# Altium schematic sheet IO.SchDoc
size A2
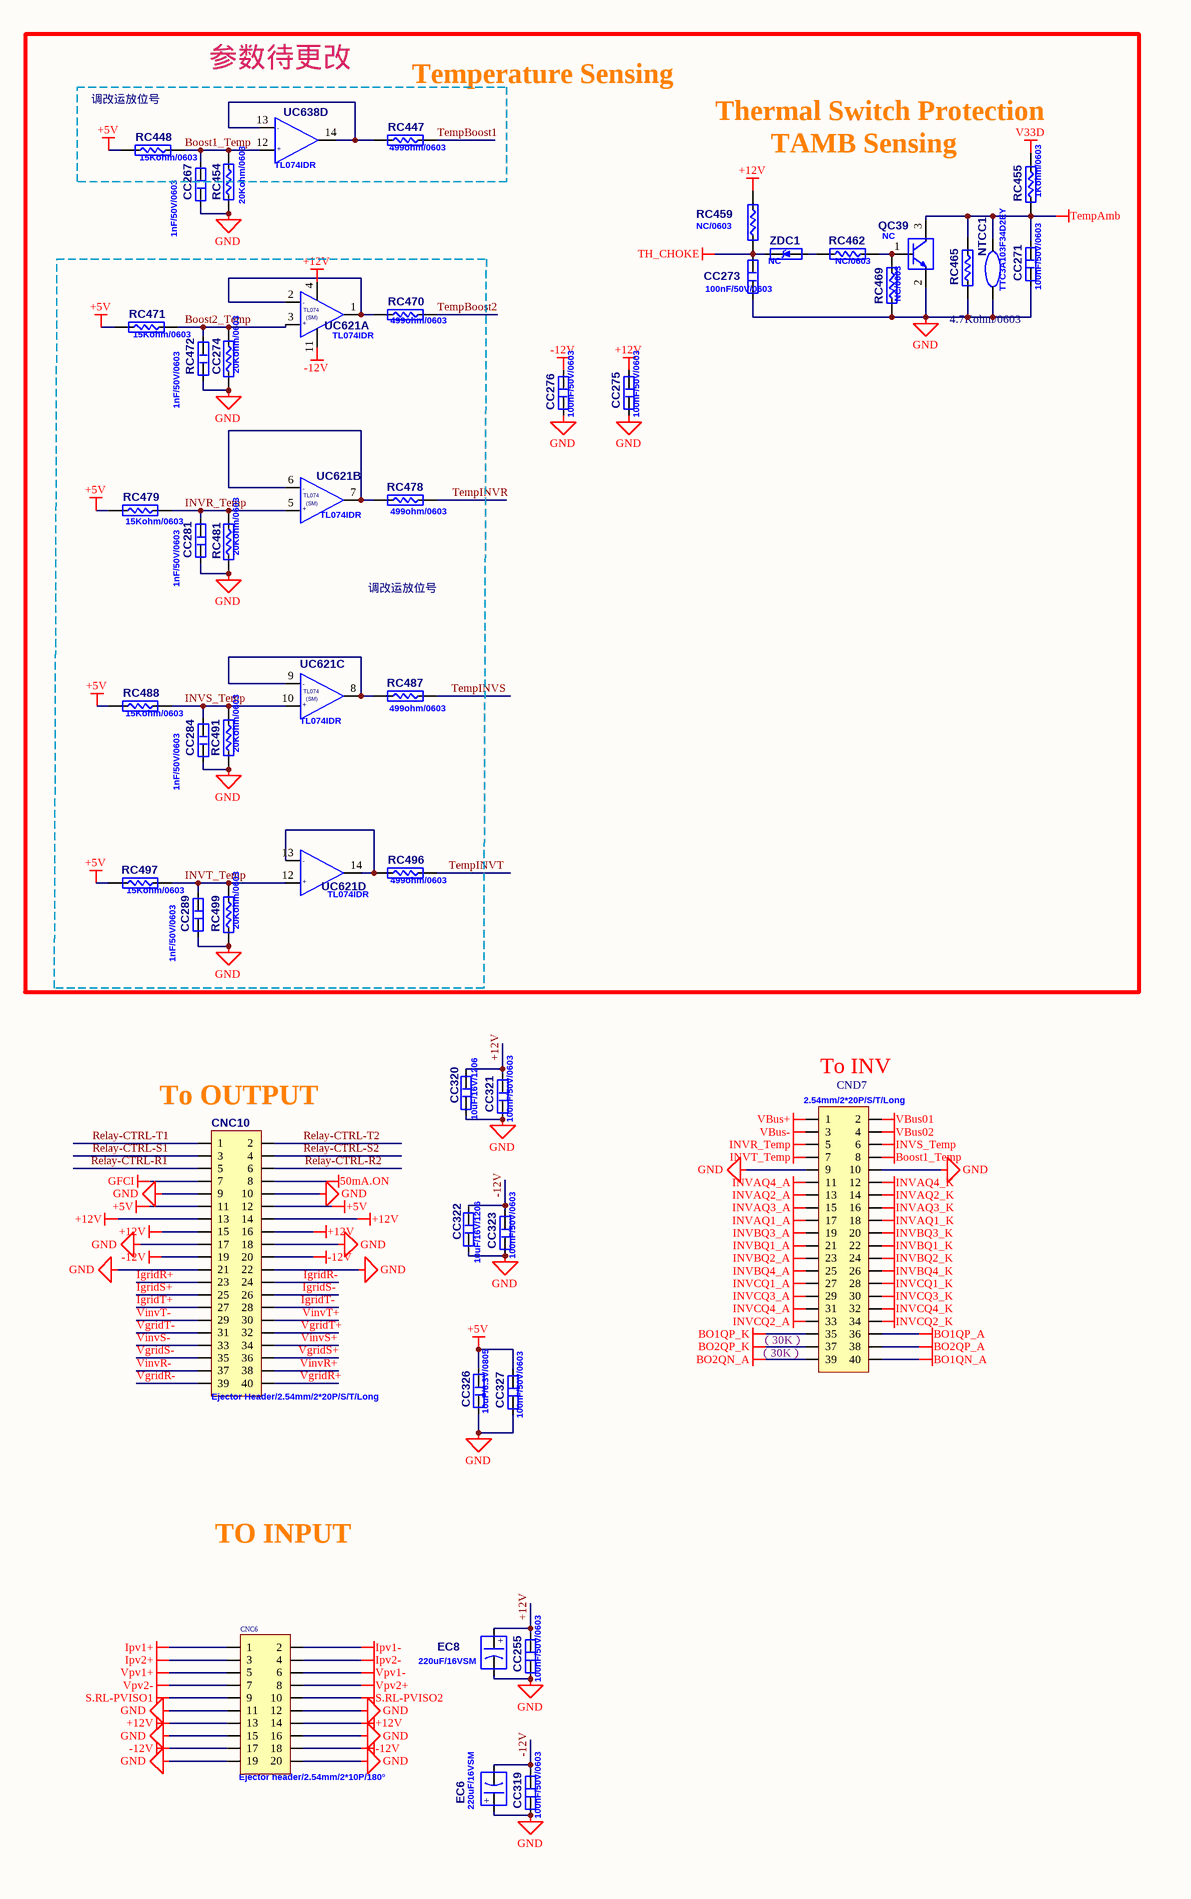
[diagram p0: IO.SchDoc, left]
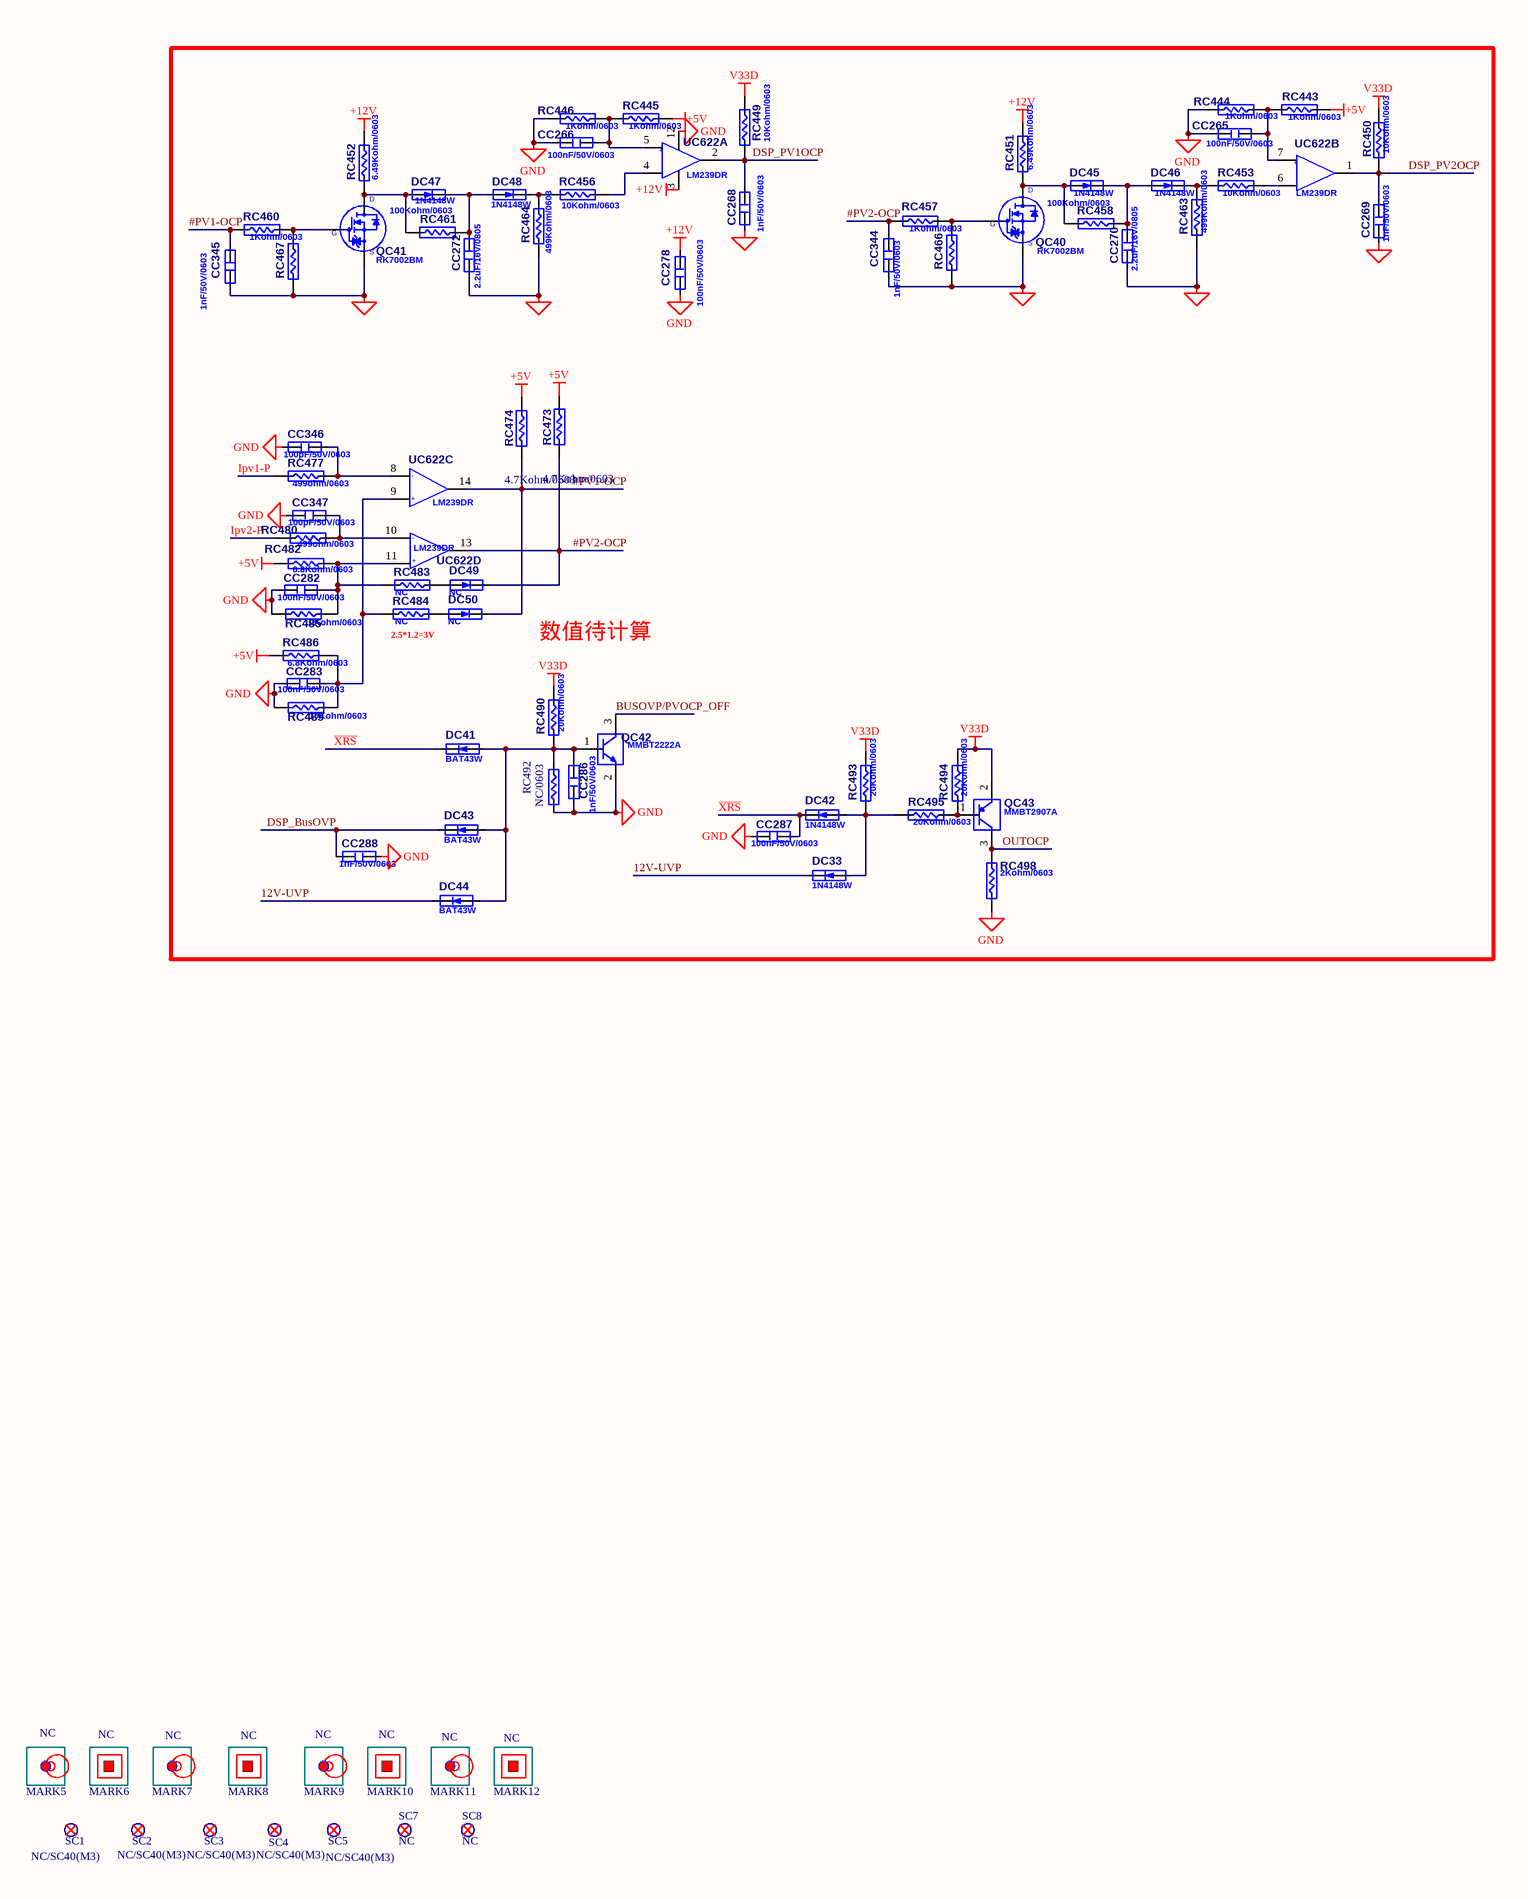
[diagram p1: IO.SchDoc, right]

## Parts
CC255  value 100nF/50V/0603  [CC1608-0603]  (hidden comment: 023-105220-0)
CC265  value 100nF/50V/0603  [CC1608-0603]  (hidden comment: 023-105220-0)
CC266  value 100nF/50V/0603  [CC1608-0603]  (hidden comment: 023-105220-0)
CC267  value 1nF/50V/0603  [CC1608-0603]  (hidden comment: 023-102220-0)
CC268  value 1nF/50V/0603  [CC1608-0603]  (hidden comment: 023-102220-0)
CC269  value 1nF/50V/0603  [CC1608-0603]  (hidden comment: 023-102220-0)
CC270  value 2.2uF/16V/0805  [CC2012-0805]  (hidden comment: 023-225330-0)
CC271  value 100nF/50V/0603  [CC1608-0603]  (hidden comment: 023-105220-0)
CC272  value 2.2uF/16V/0805  [CC2012-0805]  (hidden comment: 023-225330-0)
CC273  value 100nF/50V/0603  [CC1608-0603]  (hidden comment: 023-105220-0)
CC274  value 1nF/50V/0603  [CC1608-0603]  (hidden comment: 023-102220-0)
CC275  value 100nF/50V/0603  [CC1608-0603]  (hidden comment: 023-105220-0)
CC276  value 100nF/50V/0603  [CC1608-0603]  (hidden comment: 023-105220-0)
CC278  value 100nF/50V/0603  [CC1608-0603]  (hidden comment: 023-105220-0)
CC281  value 1nF/50V/0603  [CC1608-0603]  (hidden comment: 023-102220-0)
CC282  value 100nF/50V/0603  [CC1608-0603]  (hidden comment: 023-105220-0)
CC283  value 100nF/50V/0603  [CC1608-0603]  (hidden comment: 023-105220-0)
CC284  value 1nF/50V/0603  [CC1608-0603]  (hidden comment: 023-102220-0)
CC286  value 1nF/50V/0603  [CC1608-0603]  (hidden comment: 023-102220-0)
CC287  value 100nF/50V/0603  [CC1608-0603]  (hidden comment: 023-105220-0)
CC288  value 1nF/50V/0603  [CC1608-0603]  (hidden comment: 023-102220-0)
CC289  value 1nF/50V/0603  [CC1608-0603]  (hidden comment: 023-102220-0)
CC319  value 100nF/50V/0603  [CC1608-0603]  (hidden comment: 023-105220-0)
CC320  value 10uF/16V/1206  [CC3216-1206]  (hidden comment: 023-106350-0)
CC321  value 100nF/50V/0603  [CC1608-0603]  (hidden comment: 023-105220-0)
CC322  value 10uF/16V/1206  [CC3216-1206]  (hidden comment: 023-106350-0)
CC323  value 100nF/50V/0603  [CC1608-0603]  (hidden comment: 023-105220-0)
CC326  value 10uF/6.3V/0805  [CC2012-0805]  (hidden comment: 023-106330-0)
CC327  value 100nF/50V/0603  [CC1608-0603]  (hidden comment: 023-105220-0)
CC344  value 1nF/50V/0603  [CC1608-0603]  (hidden comment: 023-102220-0)
CC345  value 1nF/50V/0603  [CC1608-0603]  (hidden comment: 023-102220-0)
CC346  value 100pF/50V/0603  [CC1608-0603]  (hidden comment: 023-101220-0)
CC347  value 100pF/50V/0603  [CC1608-0603]  (hidden comment: 023-101220-0)
CNC6  value Ejector header/2.54mm/2*10P/180°  [CN2.54-2*10P_2]  (hidden comment: 110-103250-0)
CNC10  value Ejector Header/2.54mm/2*20P/S/T/Long  [CN2.54-2*20P]  (hidden comment: 110-310000-0)
CND7  value 2.54mm/2*20P/S/T/Long  [CN2.54-2*20P]  (hidden comment: 110-310000-0)
DC33  value 1N4148W  [SOD-123]  (hidden comment: 060-500010-0)
DC41  value BAT43W  [SOD-123]  (hidden comment: 060-310000-0)
DC42  value 1N4148W  [SOD-123]  (hidden comment: 060-500010-0)
DC43  value BAT43W  [SOD-123]  (hidden comment: 060-310000-0)
DC44  value BAT43W  [SOD-123]  (hidden comment: 060-310000-0)
DC45  value 1N4148W  [SOD-123]  (hidden comment: 060-500010-0)
DC46  value 1N4148W  [SOD-123]  (hidden comment: 060-500010-0)
DC47  value 1N4148W  [SOD-123]  (hidden comment: 060-500010-0)
DC48  value 1N4148W  [SOD-123]  (hidden comment: 060-500010-0)
DC49  NC  [SOD-123]
DC50  NC  [SOD-123]
EC6  value 220uF/16VSM  [EC220UF/16VSM-6.3]  (hidden comment: 020-227100-1)
EC8  value 220uF/16VSM  [EC220UF/16VSM-6.3]  (hidden comment: 020-227100-1)
MARK5  NC  [MARK_A]
MARK6  NC  [MARK_B]
MARK7  NC  [MARK_A]
MARK8  NC  [MARK_B]
MARK9  NC  [MARK_A]
MARK10  NC  [MARK_B]
MARK11  NC  [MARK_A]
MARK12  NC  [MARK_B]
NTCC1  value TTC3A103F34D2EY  [TTC3A103F34D2EY]  (hidden comment: 016-103000-0)
QC39  NC  [SOT-23]
QC40  value RK7002BM  [SOT-23 - 1]  (hidden comment: 063-010010-0)
QC41  value RK7002BM  [SOT-23 - 1]  (hidden comment: 063-010010-0)
QC42  value MMBT2222A  [SOT-23]  (hidden comment: 061-010000-0)
QC43  value MMBT2907A  [SOT-23]  (hidden comment: 061-110000-0)
RC443  value 1Kohm/0603  [R1608-0603]  (hidden comment: 011-102020-0)
RC444  value 1Kohm/0603  [R1608-0603]  (hidden comment: 011-102020-0)
RC445  value 1Kohm/0603  [R1608-0603]  (hidden comment: 011-102020-0)
RC446  value 1Kohm/0603  [R1608-0603]  (hidden comment: 011-102020-0)
RC447  value 499ohm/0603  [R1608-0603]  (hidden comment: 011-491020-0)
RC448  value 15Kohm/0603  [R1608-0603]  (hidden comment: 011-153020-0)
RC449  value 10Kohm/0603  [R1608-0603]  (hidden comment: 011-103020-0)
RC450  value 10Kohm/0603  [R1608-0603]  (hidden comment: 011-103020-0)
RC451  value 6.49Kohm/0603  [R1608-0603]  (hidden comment: 011-642020-0)
RC452  value 6.49Kohm/0603  [R1608-0603]  (hidden comment: 011-642020-0)
RC453  value 10Kohm/0603  [R1608-0603]  (hidden comment: 011-103020-0)
RC454  value 20Kohm/0603  [R1608-0603]  (hidden comment: 011-203020-0)
RC455  value 1Kohm/0603  [R1608-0603]  (hidden comment: 011-102020-0)
RC456  value 10Kohm/0603  [R1608-0603]  (hidden comment: 011-103020-0)
RC457  value 1Kohm/0603  [R1608-0603]  (hidden comment: 011-102020-0)
RC458  value 100Kohm/0603  [R1608-0603]  (hidden comment: 011-104020-0)
RC459  NC/0603  [R1608-0603]
RC460  value 1Kohm/0603  [R1608-0603]  (hidden comment: 011-102020-0)
RC461  value 100Kohm/0603  [R1608-0603]  (hidden comment: 011-104020-0)
RC462  NC/0603  [R1608-0603]
RC463  value 499Kohm/0603  [R1608-0603]  (hidden comment: 011-494020-0)
RC464  value 499Kohm/0603  [R1608-0603]  (hidden comment: 011-494020-0)
RC465  value 4.7Kohm/0603  [R1608-0603]  (hidden comment: 011-472020-0)
RC466  011-493020-0  [R1608-0603]  (value not drawn)
RC467  011-493020-0  [R1608-0603]  (value not drawn)
RC469  NC/0603  [R1608-0603]
RC470  value 499ohm/0603  [R1608-0603]  (hidden comment: 011-491020-0)
RC471  value 15Kohm/0603  [R1608-0603]  (hidden comment: 011-153020-0)
RC472  value 20Kohm/0603  [R1608-0603]  (hidden comment: 011-203020-0)
RC473  value 4.7Kohm/0603  [R1608-0603]  (hidden comment: 011-472020-0)
RC474  value 4.7Kohm/0603  [R1608-0603]  (hidden comment: 011-472020-0)
RC477  value 499ohm/0603  [R1608-0603]  (hidden comment: 011-491020-0)
RC478  value 499ohm/0603  [R1608-0603]  (hidden comment: 011-491020-0)
RC479  value 15Kohm/0603  [R1608-0603]  (hidden comment: 011-153020-0)
RC480  value 499ohm/0603  [R1608-0603]  (hidden comment: 011-491020-0)
RC481  value 20Kohm/0603  [R1608-0603]  (hidden comment: 011-203020-0)
RC482  value 6.8Kohm/0603  [R1608-0603]  (hidden comment: 011-682020-0)
RC483  NC  [R1608-0603]
RC484  NC  [R1608-0603]
RC485  value 10Kohm/0603  [R1608-0603]  (hidden comment: 011-103020-0)
RC486  value 6.8Kohm/0603  [R1608-0603]  (hidden comment: 011-682020-0)
RC487  value 499ohm/0603  [R1608-0603]  (hidden comment: 011-491020-0)
RC488  value 15Kohm/0603  [R1608-0603]  (hidden comment: 011-153020-0)
RC489  value 10Kohm/0603  [R1608-0603]  (hidden comment: 011-103020-0)
RC490  value 20Kohm/0603  [R1608-0603]  (hidden comment: 011-203020-0)
RC491  value 20Kohm/0603  [R1608-0603]  (hidden comment: 011-203020-0)
RC492  NC/0603  [R0603SM]
RC493  value 20Kohm/0603  [R1608-0603]  (hidden comment: 011-203020-0)
RC494  value 20Kohm/0603  [R1608-0603]  (hidden comment: 011-203020-0)
RC495  value 20Kohm/0603  [R1608-0603]  (hidden comment: 011-203020-0)
RC496  value 499ohm/0603  [R1608-0603]  (hidden comment: 011-491020-0)
RC497  value 15Kohm/0603  [R1608-0603]  (hidden comment: 011-153020-0)
RC498  value 2Kohm/0603  [R1608-0603]  (hidden comment: 011-202020-0)
RC499  value 20Kohm/0603  [R1608-0603]  (hidden comment: 011-203020-0)
SC1  NC/SC40(M3)  [SC40_M3]
SC2  NC/SC40(M3)  [SC40_M3]
SC3  NC/SC40(M3)  [SC40_M3]
SC4  NC/SC40(M3)  [SC40_M3]
SC5  NC/SC40(M3)  [SC40_M3]
SC7  NC  [SC-MC]
SC8  NC  [SC-MC]
UC621  value TL074IDR  [SO14]  (hidden comment: 050-612020-0)  (parts A,B,C,D of 4)
UC622  value LM239DR  [SO14]  (hidden comment: 050-610030-0)  (parts A,B,C,D of 4)
UC638  value TL074IDR  [SO14]  (hidden comment: 050-612020-0)  (part D of 4)
ZDC1  NC  [SOD-123]

## Blocks framed on the sheet
数值待计算: CC265 CC266 CC268-CC270 CC272 CC278 CC282 CC283 CC286-CC288 CC344-CC347 DC33 DC41-DC50 QC40-QC43 RC443-RC446 RC449-RC453 RC456-RC458 RC460 RC461 RC463 RC464 RC466 RC467 RC473 RC474 RC477 RC480 RC482-RC486 RC489 RC490 RC492-RC495 RC498 UC622
调改运放位号: CC274 CC281 CC284 CC289 RC470-RC472 RC478 RC479 RC481 RC487 RC488 RC491 RC496 RC497 RC499 UC621

## Nets
50mA.ON: CNC10.8
+5V: CC326.2 CC327.1 CNC10.11 CNC10.12 RC443.2 RC445.2 RC448.2 RC471.2 RC473.2 RC474.2 RC479.2 RC482.1 RC486.1 RC488.2 RC497.2
+12V: CC255.1 CC275.1 CC278.1 CC320.2 CC321.1 CNC6.13 CNC6.14 CNC10.13 CNC10.14 CNC10.15 CNC10.16 EC8.1 RC451.2 RC452.2 RC459.1 UC621.4 UC622.3
-12V: CC276.1 CC319.1 CC322.2 CC323.1 CNC6.17 CNC6.18 CNC10.19 CNC10.20 EC6.2 UC621.11
BO1QN_A: CND7.40
BO1QP_A: CND7.36
BO1QP_K: CND7.35
BO2QN_A: CND7.39
BO2QP_A: CND7.38
BO2QP_K: CND7.37
Boost1_Temp: CC267.1 CND7.8 RC448.1 RC454.1 UC638.12
GFCI: CNC10.7
GND: CC255.2 CC265.1 CC266.1 CC267.2 CC268.2 CC269.2 CC270.1 CC271.2 CC272.1 CC273.2 CC274.2 CC275.2 CC276.2 CC278.2 CC281.2 CC282.1 CC283.1 CC284.2 CC286.1 CC287.2 CC288.2 CC289.2 CC319.2 CC320.1 CC321.2 CC322.1 CC323.2 CC326.1 CC327.2 CC344.2 CC345.2 CC346.1 CC347.1 CNC6.11 CNC6.12 CNC6.15 CNC6.16 CNC6.19 CNC6.20 CNC10.9 CNC10.10 CNC10.17 CNC10.18 CNC10.21 CNC10.22 CND7.9 CND7.10 EC6.1 EC8.2 NTCC1.2 QC39.2 QC40.1 QC41.1 QC42.2 RC444.1 RC446.1 RC454.2 RC463.1 RC464.1 RC465.2 RC466.1 RC467.1 RC469.2 RC472.2 RC481.2 RC485.1 RC489.1 RC491.2 RC492.1 RC498.1 RC499.2 UC622.12
INVAQ1_A: CND7.17
INVAQ1_K: CND7.18
INVAQ2_A: CND7.13
INVAQ2_K: CND7.14
INVAQ3_A: CND7.15
INVAQ3_K: CND7.16
INVAQ4_A: CND7.11
INVAQ4_K: CND7.12
INVBQ1_A: CND7.21
INVBQ1_K: CND7.22
INVBQ2_A: CND7.23
INVBQ2_K: CND7.24
INVBQ3_A: CND7.19
INVBQ3_K: CND7.20
INVBQ4_A: CND7.25
INVBQ4_K: CND7.26
INVCQ1_A: CND7.27
INVCQ1_K: CND7.28
INVCQ2_A: CND7.33
INVCQ2_K: CND7.34
INVCQ3_A: CND7.29
INVCQ3_K: CND7.30
INVCQ4_A: CND7.31
INVCQ4_K: CND7.32
INVR_Temp: CC281.1 CND7.5 RC479.1 RC481.1 UC621.5
INVS_Temp: CC284.1 CND7.6 RC488.1 RC491.1 UC621.10
INVT_Temp: CC289.1 CND7.7 RC497.1 RC499.1 UC621.12
Ipv1+: CNC6.1
Ipv1-: CNC6.2
Ipv2+: CNC6.3
Ipv2-: CNC6.4
S.RL-PVISO1: CNC6.9
S.RL-PVISO2: CNC6.10
TempAmb: CC271.1 NTCC1.1 QC39.3 RC455.2 RC465.1
TH_CHOKE: CC273.1 RC459.2 ZDC1.2
V33D: QC43.2 RC449.1 RC450.1 RC455.1 RC490.2 RC493.2 RC494.1
VBus01: CND7.2
VBus02: CND7.4
VBus+: CND7.1
VBus-: CND7.3
Vpv1+: CNC6.5
Vpv1-: CNC6.6
Vpv2+: CNC6.8
Vpv2-: CNC6.7
12V-UVP: DC33.2 DC44.2
#PV1-OCP: CC345.1 DC50.2 RC460.2 RC474.1 UC622.14
#PV2-OCP: CC344.1 DC49.2 RC457.2 RC473.1 UC622.13
Boost2_Temp: CC274.1 RC471.1 RC472.1 UC621.3
BUSOVP/PVOCP_OFF: QC42.3
DSP_BusOVP: CC288.1 DC43.2
DSP_PV1OCP: CC268.1 RC449.2 UC622.2
DSP_PV2OCP: CC269.1 RC450.2 UC622.1
IgridR+: CNC10.23
IgridR-: CNC10.24
IgridS+: CNC10.25
IgridS-: CNC10.26
IgridT+: CNC10.27
IgridT-: CNC10.28
Ipv1-P: RC477.1
Ipv2-P: RC480.1
OUTOCP: QC43.3 RC498.2
Relay-CTRL-R1: CNC10.5
Relay-CTRL-R2: CNC10.6
Relay-CTRL-S1: CNC10.3
Relay-CTRL-S2: CNC10.4
Relay-CTRL-T1: CNC10.1
Relay-CTRL-T2: CNC10.2
TempBoost1: RC447.1
TempBoost2: RC470.1
TempINVR: RC478.1
TempINVS: RC487.1
TempINVT: RC496.1
VgridR+: CNC10.40
VgridR-: CNC10.39
VgridS+: CNC10.36
VgridS-: CNC10.35
VgridT+: CNC10.32
VgridT-: CNC10.31
VinvR+: CNC10.38
VinvR-: CNC10.37
VinvS+: CNC10.34
VinvS-: CNC10.33
VinvT+: CNC10.30
VinvT-: CNC10.29
~{XRS}: CC287.1 DC41.2 DC42.2
NetCC265_2: CC265.2 RC443.1 RC444.2 UC622.7
NetCC266_2: CC266.2 RC445.1 RC446.2 UC622.5
NetCC270_2: CC270.2 DC45.2 DC46.1 RC458.2
NetCC272_2: CC272.2 DC47.2 DC48.1 RC461.2
NetCC282_2: CC282.2 RC482.2 RC483.1 RC485.2 UC622.11
NetCC283_2: CC283.2 RC484.1 RC486.2 RC489.2 UC622.9
NetCC286_2: CC286.2 DC41.1 DC43.1 DC44.1 QC42.1 RC490.1 RC492.2
NetCC346_2: CC346.2 RC477.2 UC622.8
NetCC347_2: CC347.2 RC480.2 UC622.10
NetDC33_1: DC33.1 DC42.1 RC493.1 RC495.2
NetDC45_1: DC45.1 QC40.3 RC451.1 RC458.1
NetDC46_2: DC46.2 RC453.1 RC463.2
NetDC47_1: DC47.1 QC41.3 RC452.1 RC461.1
NetDC48_2: DC48.2 RC456.1 RC464.2
NetDC49_1: DC49.1 RC483.2
NetDC50_1: DC50.1 RC484.2
NetQC39_1: QC39.1 RC462.1 RC469.1
NetQC40_2: QC40.2 RC457.1 RC466.2
NetQC41_2: QC41.2 RC460.1 RC467.2
NetQC43_1: QC43.1 RC494.2 RC495.1
NetRC447_2: RC447.2 UC638.13 UC638.14
NetRC453_2: RC453.2 UC622.6
NetRC456_2: RC456.2 UC622.4
NetRC462_2: RC462.2 ZDC1.1
NetRC470_2: RC470.2 UC621.1 UC621.2
NetRC478_2: RC478.2 UC621.6 UC621.7
NetRC487_2: RC487.2 UC621.8 UC621.9
NetRC496_2: RC496.2 UC621.13 UC621.14

Not connected (* = marked no-connect by the designer): SC1 1*; SC2 1*; SC3 1*; SC4 1*; SC5 1*; SC7 1*; SC8 1*

## Notes on the sheet
- 参数待更改
- (near RC447) Temperature Sensing
- (near RC448) 调改运放位号
- (near RC455) Thermal Switch Protection
- TAMB Sensing
- (near RC484) 2.5*1.2=3V
- (near CND7) To INV
- (near CNC10) To OUTPUT
- (near CND7) （30K）
- TO INPUT
- (in symbol C220U/16VSM) +
- (in symbol IC 239SM, part A) +; -
- (in symbol IC 239SM, part B) +; -
- (in symbol IC 239SM, part C) -; +
- (in symbol IC 239SM, part D) -; +
- (in symbol IC TL074SM, part A) -; TL074; (SM); +
- (in symbol IC TL074SM, part B) -; TL074; (SM); +
- (in symbol IC TL074SM, part C) -; TL074; (SM); +
- (in symbol IC TL074SM, part D) -; +
- (in symbol MOS RK7002SM) D; G; S

## Library data of the parts
CC255 CC265 CC266 CC271 CC275 CC276 CC278 CC282 CC283 CC287 CC319 CC321 CC323 CC327 = C0603 SM: 100nF/50V/J/X7R/0603
CC267-CC269 CC274 CC281 CC284 CC286 CC288 CC289 CC344 CC345 = C0603 SM: 1nF/50V/J/C0G/0603
CC270 CC272 = C0805 SM: 2.2uF/16V/K/X7R/0805
CC273 = C0603 SM: 100nF/50V/J/X7R/0603; PN: 023-104320-0
CC320 CC322 = C1206 SM: 10uF/16V/K/X7R/1206; Type: SMD
CC326 = C0603 SM: 10uF/6.3V/K/X7R/0805
CC346 CC347 = C0603 SM: 100pF/50V/J/C0G/0603
CNC6 = CN2.54-2*10P: Ejector header/2.54mm/2*10P/180°
CNC10 = CN2.54-2*20P: Ejector Header/2.54mm/2*20P/S/T/Long
CND7 = CN2.54-2*20P_1: Ejector Header/2.54mm/2*20P/S/T/Long
DC33 DC42 DC45-DC48 = D 1N4148W: 0.15A/75V/SOD-123; Type: 插件
DC41 DC43 DC44 = D 1N4148W: 0.2A/30V/SOD-123; Type: 插件
DC49 DC50 = D 1N4148W: Value: NC; Type: 插件
EC6 EC8 = C220U/16VSM: 220UF/16V/土20%/105℃/6.3×8.7/7000h; Type: SMD
MARK5 MARK7 MARK9 MARK11 = MARK_A: 单位: PCS; H: MM; Value: NC
MARK6 MARK8 MARK10 MARK12 = MARK_B: 单位: PCS; H: MM; Value: NC
NTCC1 = 17K NTC TTC03: NTC/10Kohm/-40℃--125℃/F/Φ3mm/30mm; Type: 插件
QC39 = TR 2222SM: PN: 061-010000-0; Value: NC
QC40 QC41 = MOS RK7002SM: 250mA/60V/SOT-23; Vendor: ROHM
QC42 = TR 2222SM: 0.6A/40VDC/SOT-23
QC43 = TR 2907SM: 0.6A/60VDC/SOT-23
RC443-RC446 RC455 RC457 RC460 = R0603SM: 1Kohm/1/10W/F/0603
RC447 RC470 RC478 RC487 RC496 = R0603SM: 499ohm/1/10W/F/0603
RC448 RC471 RC479 RC488 RC497 = R0603SM: 15Kohm/1/10W/F/0603
RC449 RC450 RC453 RC456 RC485 RC489 = R0603SM: 10Kohm/1/10W/F/0603
RC451 RC452 = R0603SM: 6.49Kohm/1/10W/F/0603
RC454 RC472 RC481 RC490 RC491 RC493-RC495 RC499 = R0603SM: 20Kohm/1/10W/F/0603
RC458 RC461 = R0603SM: 100Kohm/1/10W/F/0603
RC459 RC462 = R0603SM: PN: 011-103020-0; Value: NC/0603
RC463 RC464 = R0603SM: 499Kohm/1/10W/F/0603
RC465 RC473 RC474 = R0603SM: 4.7Kohm/1/10W/F/0603
RC466 RC467 = R0603SM: 49.9Kohm/1/10W/F/0603; Value: 49.9Kohm/0603
RC469 = R0603SM: PN: 011-303020-0; Value: NC/0603
RC477 RC480 = R0603SM_7_1_1_1: 499ohm/1/10W/F/0603
RC482 RC486 = R0603SM_7_1_1_1: 6.8Kohm/1/10W/F/0603
RC483 RC484 = R0603SM: Value: NC
RC492 = NC R0603SM: Name of Material: 厚膜电阻; PN: 011-203020-0; Assembly type: 贴片; Value: NC/0603
RC498 = R0603SM: 2Kohm/1/10W/F/0603
SC1-SC5 = SC40_M3: NC; 物料名称: M3螺丝; 单位: PCS; H: MM; Value: NC/SC40(M3)
SC7 SC8 = SC-MC: 物料名称: 塑料孔; H: MM; Value: NC
UC621 UC638 = IC TL074SM: Operational Amplifier/SOIC-14
UC622 = IC 239SM: Quad Differential Comparator/SOIC-14
ZDC1 = DZ MMSZ7V5SM: Vendor: ON SEMI; PN: 060-210100-0; Part Type: SMD; Value: NC